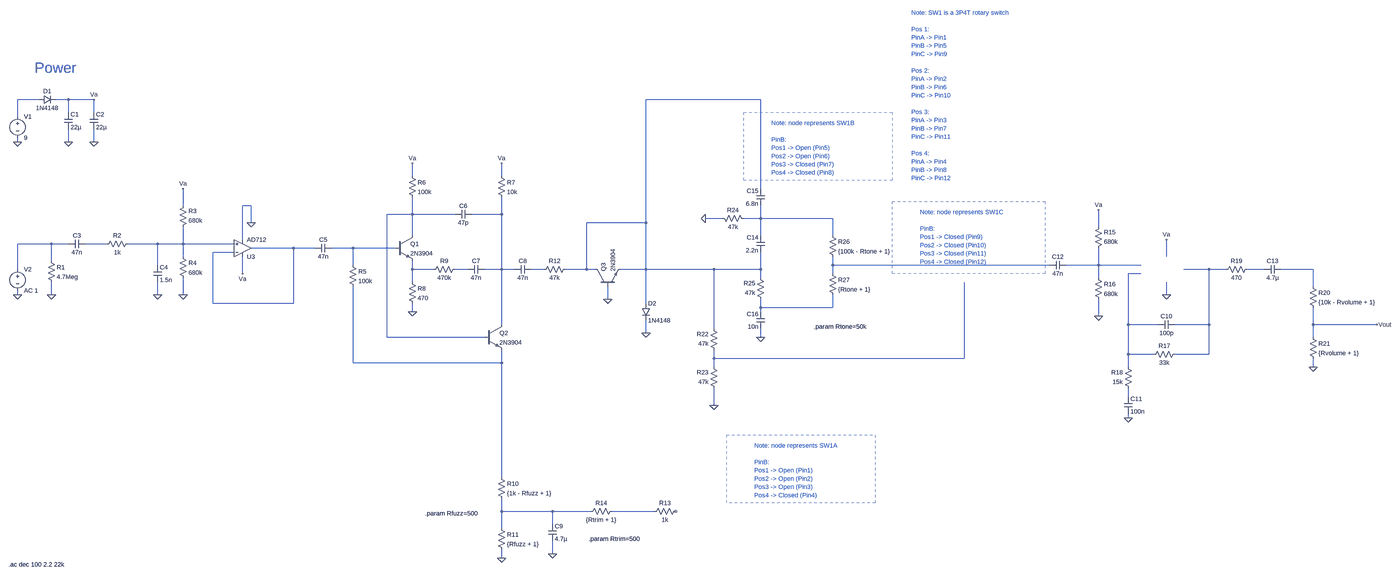
[diagram p0: schematic lovetone-big-cheese.asc, whole sheet]
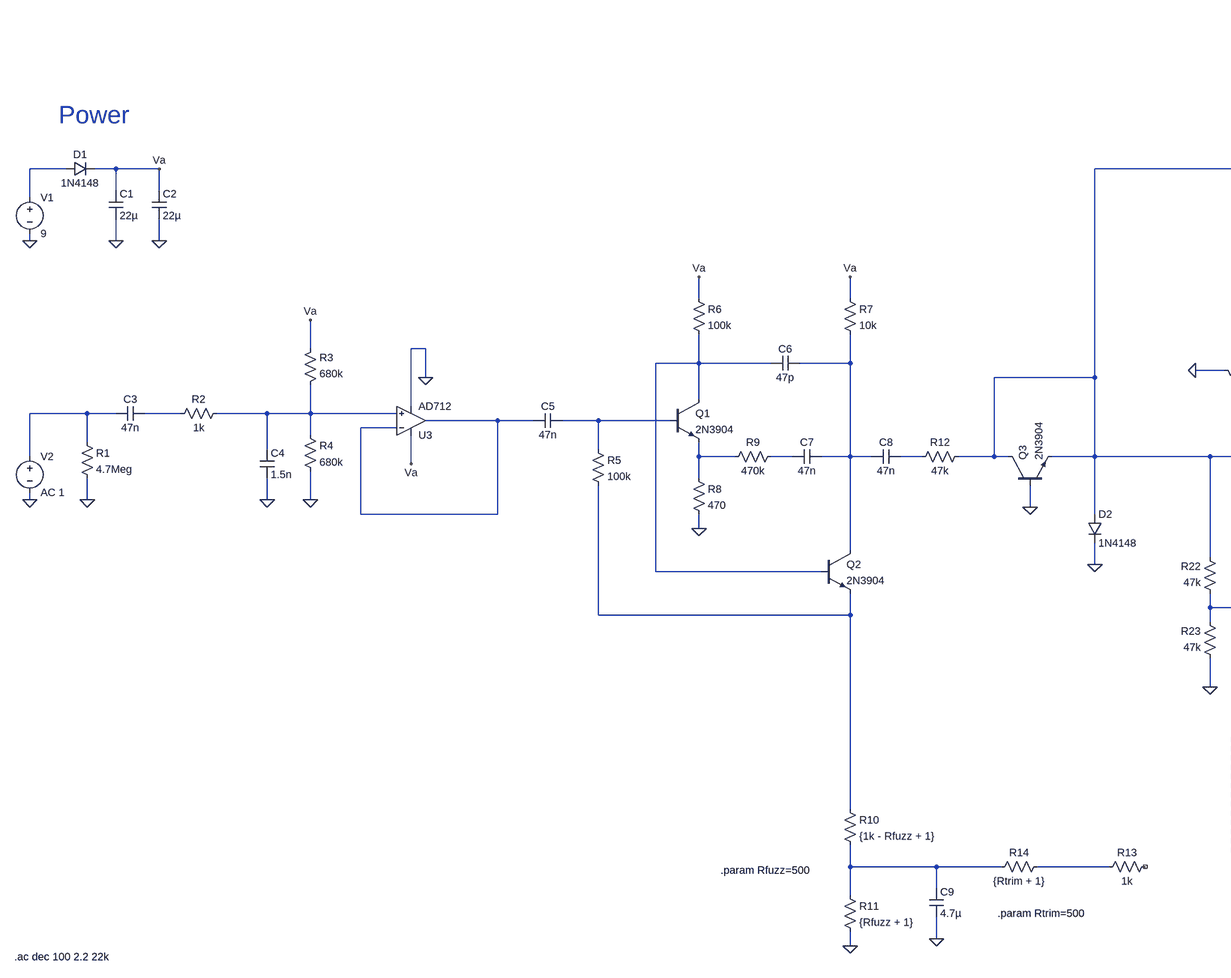
[diagram p1: schematic lovetone-big-cheese.asc, part, row 1 of 1, column 1 of 2]
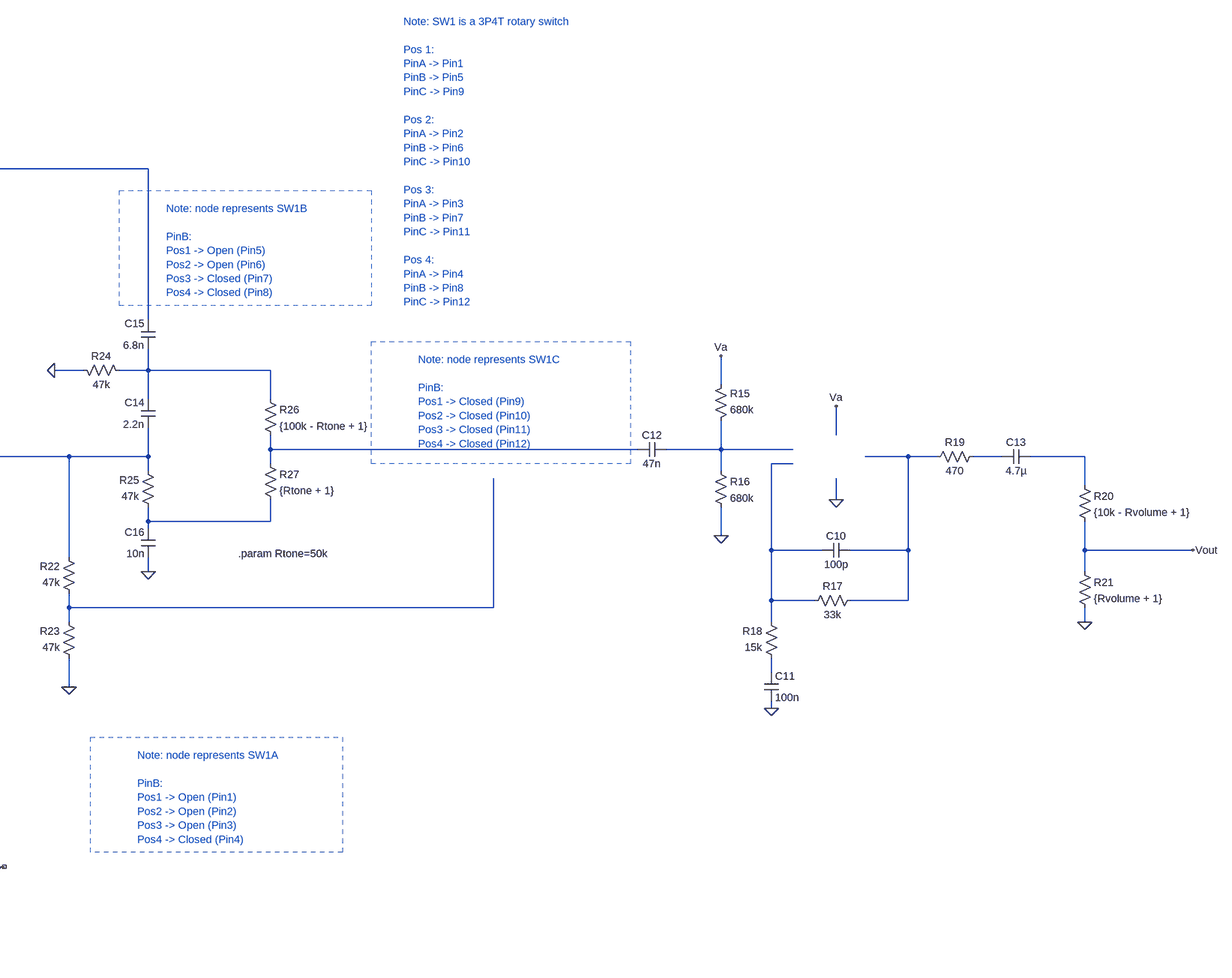
[diagram p2: schematic lovetone-big-cheese.asc, part, row 1 of 1, column 2 of 2]
lovetone-big-cheese.asc, the LTspice schematic file:
Version 4
SHEET 1 4936 1048
WIRE -208 -720 -288 -720
WIRE -96 -720 -144 -720
WIRE 0 -720 -96 -720
WIRE 2512 -720 2080 -720
WIRE -96 -672 -96 -720
WIRE 0 -672 0 -720
WIRE -288 -656 -288 -720
WIRE -288 -560 -288 -576
WIRE -96 -560 -96 -608
WIRE 0 -560 0 -608
WIRE 1200 -432 1200 -480
WIRE 1536 -432 1536 -480
WIRE 2512 -384 2512 -720
WIRE 336 -320 336 -384
WIRE 592 -320 560 -320
WIRE 1200 -288 1200 -352
WIRE 1200 -288 1104 -288
WIRE 1360 -288 1200 -288
WIRE 1536 -288 1536 -352
WIRE 1536 -288 1424 -288
WIRE 2368 -272 2304 -272
WIRE 2512 -272 2512 -320
WIRE 2512 -272 2448 -272
WIRE 2784 -272 2512 -272
WIRE 592 -256 592 -320
WIRE 2080 -256 2080 -720
WIRE 2080 -256 1856 -256
WIRE 3792 -240 3792 -304
WIRE 1200 -208 1200 -288
WIRE 2512 -208 2512 -272
WIRE 2784 -208 2784 -272
WIRE 560 -192 560 -320
WIRE -160 -176 -288 -176
WIRE -96 -176 -160 -176
WIRE 48 -176 -32 -176
WIRE 240 -176 128 -176
WIRE 336 -176 336 -240
WIRE 336 -176 240 -176
WIRE 528 -176 336 -176
WIRE 752 -160 592 -160
WIRE 832 -160 752 -160
WIRE 976 -160 896 -160
WIRE 1136 -160 976 -160
WIRE 528 -144 448 -144
WIRE 336 -128 336 -176
WIRE 4048 -128 4048 -192
WIRE -160 -112 -160 -176
WIRE 240 -96 240 -176
WIRE 976 -96 976 -160
WIRE 2784 -96 2784 -128
WIRE 3600 -96 2784 -96
WIRE 3792 -96 3792 -160
WIRE 3792 -96 3664 -96
WIRE 3952 -96 3792 -96
WIRE -288 -80 -288 -176
WIRE 1200 -80 1200 -112
WIRE 1280 -80 1200 -80
WIRE 1408 -80 1360 -80
WIRE 1536 -80 1536 -288
WIRE 1536 -80 1472 -80
WIRE 1584 -80 1536 -80
WIRE 1696 -80 1648 -80
WIRE 1856 -80 1856 -256
WIRE 1856 -80 1776 -80
WIRE 1888 -80 1856 -80
WIRE 2080 -80 2080 -256
WIRE 2080 -80 1984 -80
WIRE 2336 -80 2080 -80
WIRE 2512 -80 2512 -144
WIRE 2512 -80 2336 -80
WIRE 4208 -80 4112 -80
WIRE 4272 -80 4208 -80
WIRE 4416 -80 4352 -80
WIRE 4624 -80 4480 -80
WIRE 560 -64 560 -128
WIRE 2784 -64 2784 -96
WIRE 3952 -64 3904 -64
WIRE 2512 -48 2512 -80
WIRE 3792 -48 3792 -96
WIRE 1200 -32 1200 -80
WIRE 4624 -16 4624 -80
WIRE -288 16 -288 0
WIRE -160 16 -160 -32
WIRE 240 16 240 -32
WIRE 336 16 336 -48
WIRE 4048 16 4048 -32
WIRE 1936 32 1936 -16
WIRE 448 48 448 -144
WIRE 752 48 752 -160
WIRE 752 48 448 48
WIRE 2080 48 2080 -80
WIRE 2512 64 2512 32
WIRE 2784 64 2784 16
WIRE 2784 64 2512 64
WIRE 1200 80 1200 48
WIRE 2512 80 2512 64
WIRE 3792 96 3792 32
WIRE 1536 128 1536 -80
WIRE 3904 128 3904 -64
WIRE 4016 128 3904 128
WIRE 4208 128 4208 -80
WIRE 4208 128 4080 128
WIRE 4624 128 4624 64
WIRE 4864 128 4624 128
WIRE 2336 144 2336 -80
WIRE 2080 160 2080 112
WIRE 1104 176 1104 -288
WIRE 1472 176 1104 176
WIRE 2512 176 2512 144
WIRE 4624 176 4624 128
WIRE 3904 240 3904 128
WIRE 4000 240 3904 240
WIRE 4208 240 4208 128
WIRE 4208 240 4080 240
WIRE 2336 256 2336 224
WIRE 3280 256 3280 -32
WIRE 3280 256 2336 256
WIRE 976 272 976 -16
WIRE 1536 272 1536 224
WIRE 1536 272 976 272
WIRE 2336 288 2336 256
WIRE 3904 288 3904 240
WIRE 4624 288 4624 256
WIRE 3904 400 3904 368
WIRE 2336 432 2336 368
WIRE 3904 480 3904 464
WIRE 1536 704 1536 272
WIRE 1536 832 1536 784
WIRE 1728 832 1536 832
WIRE 1872 832 1728 832
WIRE 2112 832 1952 832
WIRE 1728 880 1728 832
WIRE 1536 896 1536 832
WIRE 1728 992 1728 944
WIRE 1536 1008 1536 976
FLAG 592 -256 0
FLAG -96 -560 0
FLAG 0 -560 0
FLAG -288 -560 0
FLAG 240 16 0
FLAG -160 16 0
FLAG -288 16 0
FLAG 336 16 0
FLAG 0 -720 Va
FLAG 336 -384 Va
FLAG 560 -64 Va
FLAG 1200 -480 Va
FLAG 1536 -480 Va
FLAG 1200 80 0
FLAG 1936 32 0
FLAG 1536 1008 0
FLAG 1728 992 0
FLAG 4048 16 0
FLAG 3792 96 0
FLAG 3792 -304 Va
FLAG 4048 -192 Va
FLAG 3904 480 0
FLAG 4624 288 0
FLAG 4864 128 Vout
FLAG 2080 160 0
FLAG 2336 432 0
FLAG 2304 -272 0
FLAG 2512 176 0
SYMBOL diode -208 -704 R270
WINDOW 0 32 32 VTop 2
WINDOW 3 0 32 VBottom 2
SYMATTR InstName D1
SYMATTR Value 1N4148
SYMBOL cap -112 -672 R0
SYMATTR InstName C1
SYMATTR Value 22µ
SYMBOL cap -16 -672 R0
SYMATTR InstName C2
SYMATTR Value 22µ
SYMBOL voltage -288 -672 R0
WINDOW 123 0 0 Left 0
WINDOW 39 0 0 Left 0
SYMATTR InstName V1
SYMATTR Value 9
SYMBOL res -176 -128 R0
SYMATTR InstName R1
SYMATTR Value 4.7Meg
SYMBOL cap -32 -192 R90
WINDOW 0 0 32 VBottom 2
WINDOW 3 32 32 VTop 2
SYMATTR InstName C3
SYMATTR Value 47n
SYMBOL res 144 -192 R90
WINDOW 0 0 56 VBottom 2
WINDOW 3 32 56 VTop 2
SYMATTR InstName R2
SYMATTR Value 1k
SYMBOL res 320 -224 M180
WINDOW 0 36 76 Left 2
WINDOW 3 36 40 Left 2
SYMATTR InstName R3
SYMATTR Value 680k
SYMBOL cap 224 -96 R0
SYMATTR InstName C4
SYMATTR Value 1.5n
SYMBOL voltage -288 -96 R0
WINDOW 123 0 0 Left 0
WINDOW 39 0 0 Left 0
SYMATTR InstName V2
SYMATTR Value AC 1
SYMBOL res 320 -144 R0
SYMATTR InstName R4
SYMATTR Value 680k
SYMBOL cap 896 -176 R90
WINDOW 0 0 32 VBottom 2
WINDOW 3 32 32 VTop 2
SYMATTR InstName C5
SYMATTR Value 47n
SYMBOL res 960 -112 R0
SYMATTR InstName R5
SYMATTR Value 100k
SYMBOL res 1184 -448 R0
SYMATTR InstName R6
SYMATTR Value 100k
SYMBOL cap 1424 -304 R90
WINDOW 0 0 32 VBottom 2
WINDOW 3 32 32 VTop 2
SYMATTR InstName C6
SYMATTR Value 47p
SYMBOL res 1520 -448 R0
SYMATTR InstName R7
SYMATTR Value 10k
SYMBOL npn 1136 -208 R0
SYMATTR InstName Q1
SYMATTR Value 2N3904
SYMBOL res 1184 -48 R0
SYMATTR InstName R8
SYMATTR Value 470
SYMBOL res 1376 -96 R90
WINDOW 0 0 56 VBottom 2
WINDOW 3 32 56 VTop 2
SYMATTR InstName R9
SYMATTR Value 470k
SYMBOL cap 1472 -96 R90
WINDOW 0 0 32 VBottom 2
WINDOW 3 32 32 VTop 2
SYMATTR InstName C7
SYMATTR Value 47n
SYMBOL npn 1472 128 R0
SYMATTR InstName Q2
SYMATTR Value 2N3904
SYMBOL res 1520 688 R0
SYMATTR InstName R10
SYMATTR Value {1k - Rfuzz + 1}
SYMBOL res 1520 880 R0
SYMATTR InstName R11
SYMATTR Value {Rfuzz + 1}
SYMBOL cap 1648 -96 R90
WINDOW 0 0 32 VBottom 2
WINDOW 3 32 32 VTop 2
SYMATTR InstName C8
SYMATTR Value 47n
SYMBOL res 1792 -96 R90
WINDOW 0 0 56 VBottom 2
WINDOW 3 32 56 VTop 2
SYMATTR InstName R12
SYMATTR Value 47k
SYMBOL npn 1888 -16 R270
SYMATTR InstName Q3
SYMATTR Value 2N3904
SYMBOL cap 1712 880 R0
SYMATTR InstName C9
SYMATTR Value 4.7µ
SYMBOL res 1968 816 R90
WINDOW 0 0 56 VBottom 2
WINDOW 3 32 56 VTop 2
SYMATTR InstName R14
SYMATTR Value {Rtrim + 1}
SYMBOL res 2208 816 R90
WINDOW 0 0 56 VBottom 2
WINDOW 3 32 56 VTop 2
SYMATTR InstName R13
SYMATTR Value 1k
SYMBOL res 3776 -144 M180
WINDOW 0 36 76 Left 2
WINDOW 3 36 40 Left 2
SYMATTR InstName R15
SYMATTR Value 680k
SYMBOL res 3776 -64 R0
SYMATTR InstName R16
SYMATTR Value 680k
SYMBOL cap 4080 112 R90
WINDOW 0 0 32 VBottom 2
WINDOW 3 32 32 VTop 2
SYMATTR InstName C10
SYMATTR Value 100p
SYMBOL res 4096 224 R90
WINDOW 0 0 56 VBottom 2
WINDOW 3 32 56 VTop 2
SYMATTR InstName R17
SYMATTR Value 33k
SYMBOL res 3920 384 R180
WINDOW 0 36 76 Left 2
WINDOW 3 36 40 Left 2
SYMATTR InstName R18
SYMATTR Value 15k
SYMBOL cap 3888 400 R0
SYMATTR InstName C11
SYMATTR Value 100n
SYMBOL cap 3664 -112 R90
WINDOW 0 0 32 VBottom 2
WINDOW 3 32 32 VTop 2
SYMATTR InstName C12
SYMATTR Value 47n
SYMBOL res 4368 -96 R90
WINDOW 0 0 56 VBottom 2
WINDOW 3 32 56 VTop 2
SYMATTR InstName R19
SYMATTR Value 470
SYMBOL cap 4480 -96 R90
WINDOW 0 0 32 VBottom 2
WINDOW 3 32 32 VTop 2
SYMATTR InstName C13
SYMATTR Value 4.7µ
SYMBOL res 4608 -32 R0
SYMATTR InstName R20
SYMATTR Value {10k - Rvolume + 1}
SYMBOL res 4608 160 R0
SYMATTR InstName R21
SYMATTR Value {Rvolume + 1}
SYMBOL diode 2064 48 R0
SYMATTR InstName D2
SYMATTR Value 1N4148
SYMBOL res 2352 240 R180
WINDOW 0 36 76 Left 2
WINDOW 3 36 40 Left 2
SYMATTR InstName R22
SYMATTR Value 47k
SYMBOL res 2352 384 R180
WINDOW 0 36 76 Left 2
WINDOW 3 36 40 Left 2
SYMATTR InstName R23
SYMATTR Value 47k
SYMBOL cap 2528 -208 M0
SYMATTR InstName C14
SYMATTR Value 2.2n
SYMBOL cap 2528 -384 M0
SYMATTR InstName C15
SYMATTR Value 6.8n
SYMBOL res 2352 -288 M90
WINDOW 0 0 56 VBottom 2
WINDOW 3 32 56 VTop 2
SYMATTR InstName R24
SYMATTR Value 47k
SYMBOL res 2528 48 R180
WINDOW 0 36 76 Left 2
WINDOW 3 36 40 Left 2
SYMATTR InstName R25
SYMATTR Value 47k
SYMBOL cap 2528 80 M0
SYMATTR InstName C16
SYMATTR Value 10n
SYMBOL res 2768 -224 R0
SYMATTR InstName R26
SYMATTR Value {100k - Rtone + 1}
SYMBOL res 2768 -80 R0
SYMATTR InstName R27
SYMATTR Value {Rtone + 1}
SYMBOL OpAmps\\AD712 560 -96 M180
SYMATTR InstName U3
TEXT -224 -840 Left 5 ;Power
TEXT 1864 936 Left 2 !.param Rtrim=500
TEXT 1248 840 Left 2 !.param Rfuzz=500
TEXT 3080 -1048 Left 2 ;Note: SW1 is a 3P4T rotary switch\n \nPos 1: \nPinA -> Pin1\nPinB -> Pin5\nPinC -> Pin9\n \nPos 2: \nPinA -> Pin2\nPinB -> Pin6\nPinC -> Pin10 \n \nPos 3: \nPinA -> Pin3\nPinB -> Pin7\nPinC -> Pin11\n \nPos 4: \nPinA -> Pin4\nPinB -> Pin8\nPinC -> Pin12
TEXT 2552 -632 Left 2 ;Note: node represents SW1B\n \nPinB: \nPos1 -> Open (Pin5)\nPos2 -> Open (Pin6)\nPos3 -> Closed (Pin7)\nPos4 -> Closed (Pin8)
TEXT 3112 -296 Left 2 ;Note: node represents SW1C\n \nPinB: \nPos1 -> Closed (Pin9)\nPos2 -> Closed (Pin10)\nPos3 -> Closed (Pin11)\nPos4 -> Closed (Pin12)
TEXT 2488 584 Left 2 ;Note: node represents SW1A\n \nPinB: \nPos1 -> Open (Pin1)\nPos2 -> Open (Pin2)\nPos3 -> Open (Pin3)\nPos4 -> Closed (Pin4)
TEXT 2712 136 Left 2 !.param Rtone=50k
TEXT -322 1032 Left 2 !.ac dec 100 2.2 22k
RECTANGLE Normal 3008 -416 2448 -672 2
RECTANGLE Normal 3584 -64 3008 -336 2
RECTANGLE Normal 2944 800 2384 544 2

The netlist it stands for:
* lovetone-big-cheese.asc
D1 N001 Va 1N4148
C1 Va 0 22µ
C2 Va 0 22µ
V1 N001 0 9
R1 N006 0 4.7Meg
C3 N007 N006 47n
R2 N008 N007 1k
R3 N008 Va 680k
C4 N008 0 1.5n
V2 N006 0 AC 1
R4 N008 0 680k
C5 N010 N009 47n
R5 N010 N022 100k
R6 Va N003 100k
C6 N004 N003 47p
R7 Va N004 10k
Q1 N003 N010 N013 0 2N3904
R8 N013 0 470
R9 N014 N013 470k
C7 N004 N014 47n
Q2 N004 N003 N022 0 2N3904
R10 N022 N024 {1k - Rfuzz + 1}
R11 N024 0 {Rfuzz + 1}
C8 N015 N004 47n
R12 N002 N015 47k
Q3 N002 0 N002 0 2N3904
C9 N024 0 4.7µ
R14 N025 N024 {Rtrim + 1}
R13 NC_01 N025 1k
R15 N012 Va 680k
R16 N012 0 680k
C10 N016 N019 100p
R17 N016 N019 33k
R18 N023 N019 15k
C11 N023 0 100n
C12 N012 N011 47n
R19 N017 N016 470
C13 N018 N017 4.7µ
R20 N018 Vout {10k - Rvolume + 1}
R21 Vout 0 {Rvolume + 1}
D2 N002 0 1N4148
R22 N021 N002 47k
R23 0 N021 47k
C14 N005 N002 2.2n
C15 N002 N005 6.8n
R24 0 N005 47k
R25 N020 N002 47k
C16 N020 0 10n
R26 N005 N011 {100k - Rtone + 1}
R27 N011 N020 {Rtone + 1}
XU3 N008 N009 Va 0 N009 AD712  ; pins In+ In- V+ V- OUT
.model D D
.lib standard.dio
.model NPN NPN
.model PNP PNP
.lib standard.bjt
* Power
.param Rtrim=500
.param Rfuzz=500
* Note: SW1 is a 3P4T rotary switch
* Pos 1:
* PinA -> Pin1
* PinB -> Pin5
* PinC -> Pin9
* Pos 2:
* PinA -> Pin2
* PinB -> Pin6
* PinC -> Pin10
* Pos 3:
* PinA -> Pin3
* PinB -> Pin7
* PinC -> Pin11
* Pos 4:
* PinA -> Pin4
* PinB -> Pin8
* PinC -> Pin12
* Note: node represents SW1B
* PinB:
* Pos1 -> Open (Pin5)
* Pos2 -> Open (Pin6)
* Pos3 -> Closed (Pin7)
* Pos4 -> Closed (Pin8)
* Note: node represents SW1C
* PinB:
* Pos1 -> Closed (Pin9)
* Pos2 -> Closed (Pin10)
* Pos3 -> Closed (Pin11)
* Pos4 -> Closed (Pin12)
* Note: node represents SW1A
* PinB:
* Pos1 -> Open (Pin1)
* Pos2 -> Open (Pin2)
* Pos3 -> Open (Pin3)
* Pos4 -> Closed (Pin4)
.param Rtone=50k
.ac dec 100 2.2 22k
.backanno
.end